# Altium project UCLA-DRS4.PrjPCB (part 10 of 10)
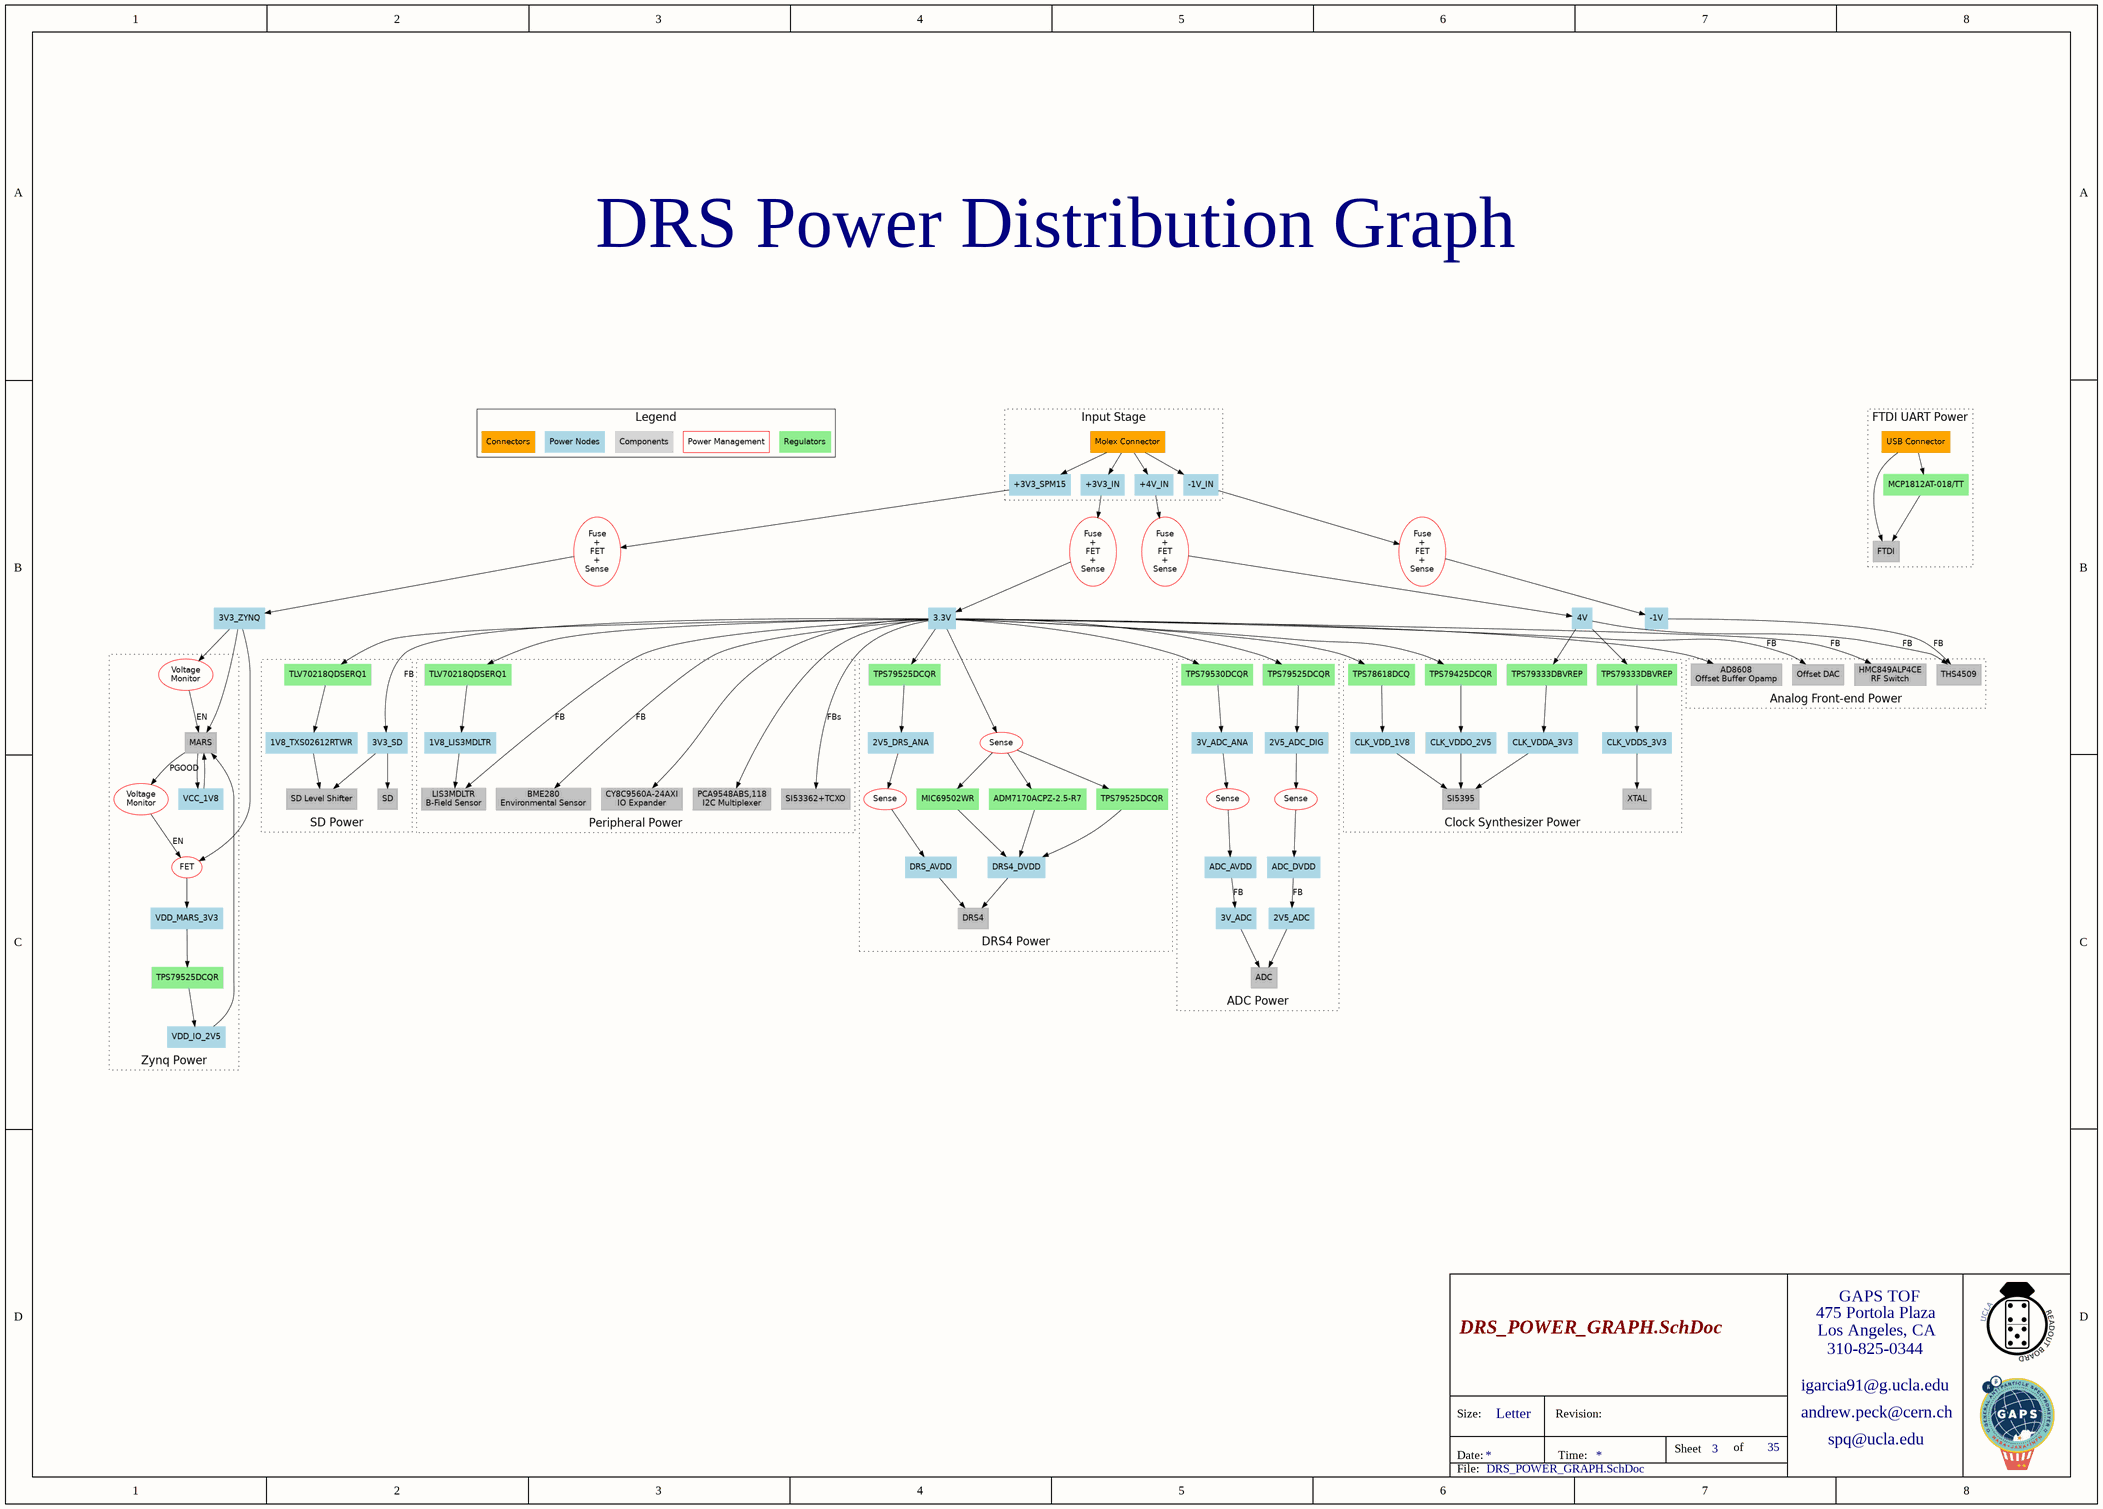
[diagram p134: DRS_POWER_GRAPH.SchDoc]

## Nets that join several sheets
1V8_TXS02612RTWR: MARS_MIO (C265.1 R18.2 U10.1 U35.5), 1V8_SUPPLY (C333.2 U7.5)
2V5_ADC_DIG: DRS4_ADC (R128.4 U24.8), 3V_ADC_SUPPLY (C27.2 TP20.1 U6.4)
2V5_DRS_ANA: DRS4 (R89.4 U18.8), 2V5_DRS4_SUPPLY (C9.2 TP10.1 U1.4)
3.3V: ToF (D25.3 D28.3 J1.5), DRS4 (16 pins), DRS-Module 0/FE0 (FB10A.1), DRS4_ADC (14 pins), DRS-Module 0/FE2 (FB10B.1), DRS-Module 0/FE4 (FB10C.1), DRS-Module 0/FE6 (FB10D.1), DRS-Module 0/FE1 (FB10E.1), DRS-Module 0/FE3 (FB10F.1), DRS-Module 0/FE5 (FB10G.1), DRS-Module 0/FE7 (FB10H.1), ANA_FE_CLK_SYNTH (FB13.1), ENET (5 pins), DAC (FB27.1 FB28.1 FB29.1), CLK_SYNTH (Q8.2 Q9.2 R48.2 R49.2), TCA_CLK_DIST (6 pins), MARS_MIO (FB23.1), CLK_PWR (8 pins), 2V5_DRS4_SUPPLY (C7.2 D8.1 R7.1 U1.2), 3V_ADC_SUPPLY (8 pins), MarsCarrier_PWR (6 pins), 3_3V_DIST (C5.1 C6.1 FB3.2 TP8.1), Sensors (23 pins), MARS_GPIO_MISC (8 pins), DRS4_GPIO_EXPANDER (8 pins), GPIO_EXPANDER_LED (J15.1), I2C_MULTIPLEX (43 pins), 1V8_SUPPLY (C334.2 U7.1 U7.3)
3V_ADC_ANA: DRS4_ADC (R127.4 U23.8), 3V_ADC_SUPPLY (C23.2 TP18.1 U5.4)
4V: DRS-Module 0/FE0 (FB11A.1), DRS-Module 0/FE2 (FB11B.1), DRS-Module 0/FE4 (FB11C.1), DRS-Module 0/FE6 (FB11D.1), DRS-Module 0/FE1 (FB11E.1), DRS-Module 0/FE3 (FB11F.1), DRS-Module 0/FE5 (FB11G.1), DRS-Module 0/FE7 (FB11H.1), ANA_FE_CLK_SYNTH (FB14.1), CLK_PWR (8 pins), 4V_DIST (C1.1 C2.1 FB1.2 TP2.1), Sensors (U30.8)
+3V3_IN: ToF (D1.1 J2.1), 3_3V_DIST (F3.1 TP7.1)
+3V3_SPM15: ToF (D2.1 J2.3), 3V3_DIST_ZYNQ (F2.1 TP5.1)
+4V_IN: ToF (D4.1 J2.7), 4V_DIST (F1.1 TP1.1)
-1V_IN: ToF (D3.1 J2.5), -1V_DIST (F4.1 TP22.1)
-1V_VBUS: DRS-Module 0/FE0 (FB12A.1), DRS-Module 0/FE2 (FB12B.1), DRS-Module 0/FE4 (FB12C.1), DRS-Module 0/FE6 (FB12D.1), DRS-Module 0/FE1 (FB12E.1), DRS-Module 0/FE3 (FB12F.1), DRS-Module 0/FE5 (FB12G.1), DRS-Module 0/FE7 (FB12H.1), ANA_FE_CLK_SYNTH (FB15.1), -1V_DIST (C29.2 C30.2 FB4.2 TP23.1), Sensors (C41.2 R124.2 U43.2)
CLK_VDD_1V8: CLK_SYNTH (6 pins), CLK_PWR (C32.2 TP25.1 U8.4)
CLK_VDDA_3V3: CLK_SYNTH (C96.2 FB6.1), CLK_PWR (C44.2 TP31.1 U11.5)
CLK_VDDO_2V5: CLK_SYNTH (16 pins), CLK_PWR (C35.2 TP27.1 U9.4)
CLK_VDDS_3V3: CLK_SYNTH (C95.1 L1.2 R58.2), CLK_PWR (C47.2 TP33.1 U12.5)
DRS4_2V5_ADM: DRS4 (J7.2), 2V5_DRS4_SUPPLY (C18.2 U4.5 U4.7 U4.8)
DRS4_2V5_MIC: DRS4 (J8.2), 2V5_DRS4_SUPPLY (5 pins)
DRS4_2V5_TPS: DRS4 (J6.2), 2V5_DRS4_SUPPLY (C11.2 D9.1 R8.1 U2.2)
DRS4_DVDD: DRS4 (20 pins), 2V5_DRS4_SUPPLY (13 pins)
NEUTRAL: ENET (T1.S1 T1.S2), MARS_FTDI (J12.6 J12.7 J12.8 J12.9)
TRB_GND: ToF (11 pins), DRS4 (62 pins), DRS-Module 0/FE0 (36 pins), DRS4_ADC (41 pins), DRS-Module 0/FE2 (36 pins), DRS-Module 0/FE4 (36 pins), DRS-Module 0/FE6 (36 pins), DRS-Module 0/FE1 (36 pins), DRS-Module 0/FE3 (36 pins), DRS-Module 0/FE5 (36 pins), DRS-Module 0/FE7 (36 pins), ANA_FE_CLK_SYNTH (38 pins), MarsCarrier (45 pins), ENET (9 pins), DAC (21 pins), CLK_SYNTH (25 pins), TCA_CLK_DIST (10 pins), TCA_LP_FILTER (54 pins), MARS_MIO (23 pins), CLK_PWR (26 pins), 2V5_DRS4_SUPPLY (27 pins), 4V_DIST (C1.2 C2.2 R2.1 TP3.1), -1V_DIST (C29.1 C30.1 TP24.1), 3V_ADC_SUPPLY (14 pins), MarsCarrier_PWR (50 pins), MARS_PORB (11 pins), 3V3_DIST_ZYNQ (C3.2 C4.2 R4.1 TP6.1), 3_3V_DIST (C5.2 C6.2 R6.1 TP9.1), Sensors (33 pins), MARS_GPIO_MISC (32 pins), MARS_FTDI (25 pins), DRS4_GPIO_EXPANDER (11 pins), GPIO_EXPANDER_LED (23 pins), I2C_HEADER (7 pins), I2C_MULTIPLEX (7 pins), 1V8_SUPPLY (C333.1 C334.1 U7.2)
VCC_1V8_PS: MarsCarrier (11 pins), MarsCarrier_PWR (5 pins)
VCC_3V3: MarsCarrier (9 pins), MarsCarrier_PWR (8 pins), MARS_PORB (9 pins), 3V3_DIST_ZYNQ (C3.1 C4.1 FB2.2 TP4.1)
VCC_IO_B34: MarsCarrier (6 pins), MarsCarrier_PWR (15 pins)
3V3_SENSE_N: 3_3V_DIST (R5.4), Sensors (R206.2)
3V3_SENSE_P: 3_3V_DIST (R5.1), Sensors (R212.2)
3V3_ZYNQ_SENSE_N: MarsCarrier_PWR (R30.1), 3V3_DIST_ZYNQ (R3.4)
3V3_ZYNQ_SENSE_P: MarsCarrier_PWR (R33.1), 3V3_DIST_ZYNQ (R3.1)
4V_SENSE_N: 4V_DIST (R1.4), Sensors (R207.2)
4V_SENSE_P: 4V_DIST (R1.1), Sensors (R213.2)
-1V_SENSE_N: -1V_DIST (R14.1), Sensors (R208.2)
-1V_SENSE_P: -1V_DIST (R14.4), Sensors (R214.2)
ADC_CLK: DRS4_ADC (U21.2), CLK_SYNTH (R50.1)
BIAS: DRS4 (R94.1), DAC (TP80.1 U37.9)
BOOT_MODE: MarsCarrier (J4.190), MarsCarrier_PWR (J3.2)
CLK_SYNTH_8: ANA_FE_CLK_SYNTH (C235.2 L6.1), CLK_SYNTH (R52.1)
DAC_~{CLR}: DRS4_GPIO_EXPANDER (U16.5), I2C_HEADER (J17.4)
DAC_~{IRQ}: DRS4_GPIO_EXPANDER (U16.4), I2C_HEADER (J17.5)
DRS4~{_RESET}: DRS4 (U17.35), MarsCarrier (J4.93)
DRS4_A0: DRS4 (U17.31), MarsCarrier (J4.99)
DRS4_A1: DRS4 (U17.32), MarsCarrier (J4.97)
DRS4_A2: DRS4 (U17.60), MarsCarrier (J4.35)
DRS4_A3: DRS4 (U17.61), MarsCarrier (J4.31)
DRS4_DENABLE: DRS4 (R101.2 U17.74), MarsCarrier (J4.19)
DRS4_DTAP: DRS4 (U17.62), MarsCarrier (J4.29)
DRS4_DWRITE: DRS4 (R102.2 U17.73), MarsCarrier (J4.23)
DRS4_IN0_N: DRS4 (R109.2 U17.4), DRS-Module 0/FE0 (R175A.2 R180A.2)
DRS4_IN0_P: DRS4 (R109.1 U17.3), DRS-Module 0/FE0 (R174A.2 R179A.2)
DRS4_IN1_N: DRS4 (R110.2 U17.6), DRS-Module 0/FE1 (R175E.2 R180E.2)
DRS4_IN1_P: DRS4 (R110.1 U17.5), DRS-Module 0/FE1 (R174E.2 R179E.2)
DRS4_IN2_N: DRS4 (R111.2 U17.8), DRS-Module 0/FE2 (R175B.2 R180B.2)
DRS4_IN2_P: DRS4 (R111.1 U17.7), DRS-Module 0/FE2 (R174B.2 R179B.2)
DRS4_IN3_N: DRS4 (R112.2 U17.10), DRS-Module 0/FE3 (R175F.2 R180F.2)
DRS4_IN3_P: DRS4 (R112.1 U17.9), DRS-Module 0/FE3 (R174F.2 R179F.2)
DRS4_IN4_N: DRS4 (R113.2 U17.12), DRS-Module 0/FE4 (R175C.2 R180C.2)
DRS4_IN4_P: DRS4 (R113.1 U17.11), DRS-Module 0/FE4 (R174C.2 R179C.2)
DRS4_IN5_N: DRS4 (R114.2 U17.14), DRS-Module 0/FE5 (R175G.2 R180G.2)
DRS4_IN5_P: DRS4 (R114.1 U17.13), DRS-Module 0/FE5 (R174G.2 R179G.2)
DRS4_IN6_N: DRS4 (R115.2 U17.16), DRS-Module 0/FE6 (R175D.2 R180D.2)
DRS4_IN6_P: DRS4 (R115.1 U17.15), DRS-Module 0/FE6 (R174D.2 R179D.2)
DRS4_IN7_N: DRS4 (R116.2 U17.18), DRS-Module 0/FE7 (R175H.2 R180H.2)
DRS4_IN7_P: DRS4 (R116.1 U17.17), DRS-Module 0/FE7 (R174H.2 R179H.2)
DRS4_IN8_N: DRS4 (R117.2 U17.21), ANA_FE_CLK_SYNTH (R186.2 R192.2)
DRS4_IN8_P: DRS4 (R117.1 U17.20), ANA_FE_CLK_SYNTH (R185.2 R191.2)
DRS4_OUT8_N: DRS4 (U17.38), DRS4_ADC (R140.1)
DRS4_OUT8_P: DRS4 (U17.37), DRS4_ADC (R143.1)
DRS4_PLLLCK: DRS4 (R98.1), MarsCarrier (J4.25)
DRS4_RSRLOAD: DRS4 (U17.29), MarsCarrier (J4.103)
DRS4_SRCLK: DRS4 (R106.1 U17.28), MarsCarrier (J4.105)
DRS4_SRIN: DRS4 (U17.27), MarsCarrier (J4.113)
DRS4_SROUT: DRS4 (U17.26), MarsCarrier (J4.115)
DRS4_WSRIN: DRS4 (U17.75), MarsCarrier (J4.17)
DRS4_WSROUT: DRS4 (U17.25), MarsCarrier (J4.119)
ETH_A_N: MarsCarrier (J4.169), ENET (D30.5 T1.11)
ETH_A_P: MarsCarrier (J4.171), ENET (D30.4 T1.10)
ETH_B_N: MarsCarrier (J4.177), ENET (D30.2 T1.5)
ETH_B_P: MarsCarrier (J4.179), ENET (D30.1 T1.4)
ETH_C_N: MarsCarrier (J4.183), ENET (D29.5 T1.3)
ETH_C_P: MarsCarrier (J4.185), ENET (D29.4 T1.2)
ETH_CTREF: MarsCarrier (J4.181), ENET (R64.2)
ETH_D_N: MarsCarrier (J4.191), ENET (D29.2 T1.9)
ETH_D_P: MarsCarrier (J4.193), ENET (D29.1 T1.8)
ETH_LED1#: MarsCarrier (J4.173), ENET (R66.2)
ETH_LED2#: MarsCarrier (J4.175), ENET (R67.2)
FPGA_DONE: MarsCarrier (J4.194), MarsCarrier_PWR (Q6.2 R28.2)
GPIO0_N: MarsCarrier (J4.125), MARS_GPIO_MISC (D54.4 J14.3)
GPIO0_P: MarsCarrier (J4.123), MARS_GPIO_MISC (D54.6 J14.1)
GPIO1_N: MarsCarrier (J4.131), MARS_GPIO_MISC (D54.3 J14.7)
GPIO1_P: MarsCarrier (J4.129), MARS_GPIO_MISC (D54.1 J14.5)
GPIO2_N: MarsCarrier (J4.135), MARS_GPIO_MISC (D55.4 J14.11)
GPIO2_P: MarsCarrier (J4.133), MARS_GPIO_MISC (D55.6 J14.9)
GPIO3_N: MarsCarrier (J4.104), MARS_GPIO_MISC (D55.3 J14.15)
GPIO3_P: MarsCarrier (J4.102), MARS_GPIO_MISC (D55.1 J14.13)
GPIO4_N: MarsCarrier (J4.110), MARS_GPIO_MISC (D56.4 J14.19)
GPIO4_P: MarsCarrier (J4.108), MARS_GPIO_MISC (D56.6 J14.17)
GPIO5_N: MarsCarrier (J4.114), MARS_GPIO_MISC (D56.3 J14.23)
GPIO5_P: MarsCarrier (J4.112), MARS_GPIO_MISC (D56.1 J14.21)
GPIO6_N: MarsCarrier (J4.120), MARS_GPIO_MISC (D57.4 J14.27)
GPIO6_P: MarsCarrier (J4.118), MARS_GPIO_MISC (D57.6 J14.25)
GPIO7_N: MarsCarrier (J4.124), MARS_GPIO_MISC (D57.3 J14.31)
GPIO7_P: MarsCarrier (J4.122), MARS_GPIO_MISC (D57.1 J14.29)
HMC849:EN0: DRS-Module 0/FE0 (U25A.5), DRS4_GPIO_EXPANDER (R68.2), GPIO_EXPANDER_LED (R301.2)
HMC849:EN1: DRS-Module 0/FE1 (U25E.5), DRS4_GPIO_EXPANDER (R71.2), GPIO_EXPANDER_LED (R302.2)
HMC849:EN2: DRS-Module 0/FE2 (U25B.5), DRS4_GPIO_EXPANDER (R73.2), GPIO_EXPANDER_LED (R303.2)
HMC849:EN3: DRS-Module 0/FE3 (U25F.5), DRS4_GPIO_EXPANDER (R75.2), GPIO_EXPANDER_LED (R304.2)
HMC849:EN4: DRS-Module 0/FE4 (U25C.5), DRS4_GPIO_EXPANDER (R77.2), GPIO_EXPANDER_LED (R317.2)
HMC849:EN5: DRS-Module 0/FE5 (U25G.5), DRS4_GPIO_EXPANDER (R79.2), GPIO_EXPANDER_LED (R318.2)
HMC849:EN6: DRS-Module 0/FE6 (U25D.5), DRS4_GPIO_EXPANDER (R81.2), GPIO_EXPANDER_LED (R319.2)
HMC849:EN7: DRS-Module 0/FE7 (U25H.5), DRS4_GPIO_EXPANDER (R83.2), GPIO_EXPANDER_LED (R320.2)
HMC849:EN8: ANA_FE_CLK_SYNTH (U26.5), DRS4_GPIO_EXPANDER (R85.2)
HMC849:VCTL0: DRS-Module 0/FE0 (U25A.2), DRS4_GPIO_EXPANDER (R70.2), GPIO_EXPANDER_LED (R305.1)
HMC849:VCTL1: DRS-Module 0/FE1 (U25E.2), DRS4_GPIO_EXPANDER (R72.2), GPIO_EXPANDER_LED (R306.1)
HMC849:VCTL2: DRS-Module 0/FE2 (U25B.2), DRS4_GPIO_EXPANDER (R74.2), GPIO_EXPANDER_LED (R307.1)
HMC849:VCTL3: DRS-Module 0/FE3 (U25F.2), DRS4_GPIO_EXPANDER (R76.2), GPIO_EXPANDER_LED (R308.1)
HMC849:VCTL4: DRS-Module 0/FE4 (U25C.2), DRS4_GPIO_EXPANDER (R78.2), GPIO_EXPANDER_LED (R321.1)
HMC849:VCTL5: DRS-Module 0/FE5 (U25G.2), DRS4_GPIO_EXPANDER (R80.2), GPIO_EXPANDER_LED (R322.1)
HMC849:VCTL6: DRS-Module 0/FE6 (U25D.2), DRS4_GPIO_EXPANDER (R82.2), GPIO_EXPANDER_LED (R323.1)
HMC849:VCTL7: DRS-Module 0/FE7 (U25H.2), DRS4_GPIO_EXPANDER (R84.2), GPIO_EXPANDER_LED (R324.1)
HMC849:VCTL8: ANA_FE_CLK_SYNTH (U26.2), DRS4_GPIO_EXPANDER (R86.2)
I2C_SCL: MarsCarrier (J4.178), MARS_MIO (R249.2 U46.4)
I2C_SDA: MarsCarrier (J4.176), MARS_MIO (R248.2 U46.5)
~{IN}~{_OFS}: DRS-Module 0/FE0 (L3A.1), DRS-Module 0/FE2 (L3B.1), DRS-Module 0/FE4 (L3C.1), DRS-Module 0/FE6 (L3D.1), DRS-Module 0/FE1 (L3E.1), DRS-Module 0/FE3 (L3F.1), DRS-Module 0/FE5 (L3G.1), DRS-Module 0/FE7 (L3H.1), ANA_FE_CLK_SYNTH (L5.1), DAC (R289.2 TP40.1)
IN+_OFS: DRS-Module 0/FE0 (L2A.2), DRS-Module 0/FE2 (L2B.2), DRS-Module 0/FE4 (L2C.2), DRS-Module 0/FE6 (L2D.2), DRS-Module 0/FE1 (L2E.2), DRS-Module 0/FE3 (L2F.2), DRS-Module 0/FE5 (L2G.2), DRS-Module 0/FE7 (L2H.2), ANA_FE_CLK_SYNTH (L4.2), DAC (R291.2 TP42.1)
IO_B34_L7_Y16_P: DRS4_ADC (R157.2), MarsCarrier (J4.59)
IO_B34_L7_Y17_N: DRS4_ADC (R154.2), MarsCarrier (J4.61)
IO_B34_L10_V15_P: DRS4_ADC (R159.2), MarsCarrier (J4.55)
IO_B34_L10_W15_N: DRS4_ADC (R158.2), MarsCarrier (J4.57)
IO_B34_L17_Y18_P: DRS4_ADC (R153.2), MarsCarrier (J4.65)
IO_B34_L17_Y19_N: DRS4_ADC (R152.2), MarsCarrier (J4.67)
IO_B34_L19_R17_N: DRS4_ADC (R160.2), MarsCarrier (J4.37)
IO_B34_L22_W18_P: DRS4_ADC (R151.2), MarsCarrier (J4.69)
IO_B34_L22_W19_N: DRS4_ADC (R150.2), MarsCarrier (J4.71)
IO_B35_L3_N: ToF (D25.1 J1.10), MarsCarrier (J4.144)
IO_B35_L3_P: ToF (D25.2 J1.9), MarsCarrier (J4.142)
IO_B35_L5_N: ToF (D25.4 J1.8), MarsCarrier (J4.140)
IO_B35_L5_P: ToF (D25.5 J1.7), MarsCarrier (J4.138)
IO_B35_L6_N: ToF (D28.4 J1.3), MarsCarrier (J4.134)
IO_B35_L6_P: ToF (D28.5 J1.4), MarsCarrier (J4.132)
IO_B35_L7_M19_P: DRS4_ADC (R146.2), MarsCarrier (J4.79)
IO_B35_L7_M20_N: DRS4_ADC (R145.2), MarsCarrier (J4.81)
IO_B35_L9_L19_P: DRS4_ADC (R144.2), MarsCarrier (J4.91)
IO_B35_L15_AD12_F20_N: MarsCarrier (J4.121), DRS4_GPIO_EXPANDER (R87.1)
IO_B35_L21_N15_P: DRS4_ADC (R149.2), MarsCarrier (J4.75)
IO_B35_L21_N16_N: DRS4_ADC (R148.2), MarsCarrier (J4.77)
IO_MIO41_B13_L16_W9: MarsCarrier (J4.141), MARS_MIO (U35.4)
IO_MIO42_B13_L18_W11: MarsCarrier (J4.143), MARS_MIO (U35.6)
IO_MIO43_B13_L18_Y11: MarsCarrier (J4.145), MARS_MIO (U35.7)
IO_MIO44_B13_L14_SRCC_Y9: MarsCarrier (J4.149), MARS_MIO (U35.1)
IO_MIO45_B13_L14_Y8: MarsCarrier (J4.151), MARS_MIO (U35.3)
IO_MIO46_B13_L19_T5: MarsCarrier (J4.153), MARS_FTDI (R197.2 R198.2)
IO_MIO47_B13_L19_U5: MarsCarrier (J4.155), MARS_FTDI (R196.2 R199.2)
MCLK_N: ToF (D28.1 J1.1), CLK_SYNTH (C89.1)
MCLK_P: ToF (D28.2 J1.2), CLK_SYNTH (C87.1)
OUT0A_N: MarsCarrier (J4.6), CLK_SYNTH (U15.20)
OUT0A_P: MarsCarrier (J4.4), CLK_SYNTH (U15.21)
OUT2_N: DRS4 (R93.2 U17.67), CLK_SYNTH (U15.30)
OUT2_P: DRS4 (R93.1 U17.66), CLK_SYNTH (U15.31)
POR: MarsCarrier (J4.196), MarsCarrier_PWR (C61.1 S2.1 S2.2), MARS_PORB (Q38.6)
POWER_EN: MarsCarrier (J4.13), MarsCarrier_PWR (R29.1), MARS_PORB (U44.5 U45.7)
POWER_GOOD: MarsCarrier (J4.40), MarsCarrier_PWR (Q6.5 R29.2)
PS_SRST#: MarsCarrier (J4.192), MarsCarrier_PWR (C62.1 S1.1 S1.2)
R-OFS: DRS4 (C127.1 C128.2 C129.2 U17.30), DAC (U37.18)
SCL: MARS_MIO (R247.1 R249.1), I2C_HEADER (J16.2 J17.2 U47.5 U48.5), I2C_MULTIPLEX (U39.19 U40.19)
SCL_3V3_INA226: Sensors (U29.5), I2C_MULTIPLEX (R365.1 U40.11)
SCL_4V_INA226: Sensors (U30.2 U30.5), I2C_MULTIPLEX (R366.1 U40.17)
SCL_-1V_MAX116: Sensors (U49.5), I2C_MULTIPLEX (R368.1 U40.15)
SCL_ADCINA226_AVDD: DRS4_ADC (U23.1 U23.2 U23.5), I2C_MULTIPLEX (R353.1 U39.13)
SCL_ADCINA226_DVDD: DRS4_ADC (U24.5), I2C_MULTIPLEX (R346.1 U39.8)
SCL_ADCTMP112: DRS4_ADC (U22.1), I2C_MULTIPLEX (R348.1 U39.11)
SCL_BME280: Sensors (U34.4), I2C_MULTIPLEX (R357.1 U40.2)
SCL_ClkSensorTMP112: Sensors (U33.1 U33.4), I2C_MULTIPLEX (R340.1 U39.2)
SCL_CY8C9560A: DRS4_GPIO_EXPANDER (U16.24), I2C_MULTIPLEX (R349.1 U39.17)
SCL_DAC: DAC (U37.3), I2C_MULTIPLEX (R344.1 U39.6)
SCL_DRS4INA226: DRS4 (U19.1 U19.5), I2C_MULTIPLEX (R363.1 U40.8)
SCL_DRS4INA226_AVDD: DRS4 (U18.5), I2C_MULTIPLEX (R351.1 U39.15)
SCL_DRS4TMP112: DRS4 (U20.1), I2C_MULTIPLEX (R361.1 U40.6)
SCL_LIS3MDLTR: Sensors (U32.1), I2C_MULTIPLEX (R359.1 U40.4)
SCL_SI5395: CLK_SYNTH (U15.16), I2C_MULTIPLEX (R342.1 U39.4)
SCL_Zynq_INA226: MarsCarrier_PWR (U14.5), I2C_MULTIPLEX (R370.1 U40.13)
SDA: MARS_MIO (R246.1 R248.1), I2C_HEADER (J16.3 J17.3 U47.4 U48.4), I2C_MULTIPLEX (U39.20 U40.20)
SDA_3V3_INA226: Sensors (U29.4), I2C_MULTIPLEX (R364.1 U40.10)
SDA_4V_INA226: Sensors (U30.4), I2C_MULTIPLEX (R367.1 U40.16)
SDA_-1V_MAX116: Sensors (U49.6), I2C_MULTIPLEX (R369.1 U40.14)
SDA_ADCINA226_AVDD: DRS4_ADC (U23.4), I2C_MULTIPLEX (R354.1 U39.12)
SDA_ADCINA226_DVDD: DRS4_ADC (U24.2 U24.4), I2C_MULTIPLEX (R345.1 U39.7)
SDA_ADCTMP112: DRS4_ADC (U22.4 U22.6), I2C_MULTIPLEX (R347.1 U39.10)
SDA_BME280: Sensors (U34.3), I2C_MULTIPLEX (R356.1 U40.1)
SDA_ClkSensorTMP112: Sensors (U33.6), I2C_MULTIPLEX (R339.1 U39.1)
SDA_CY8C9560A: DRS4_GPIO_EXPANDER (U16.28), I2C_MULTIPLEX (R350.1 U39.16)
SDA_DAC: DAC (U37.13), I2C_MULTIPLEX (R343.1 U39.5)
SDA_DRS4INA226: DRS4 (U19.2 U19.4), I2C_MULTIPLEX (R362.1 U40.7)
SDA_DRS4INA226_AVDD: DRS4 (U18.4), I2C_MULTIPLEX (R352.1 U39.14)
SDA_DRS4TMP112: DRS4 (U20.6), I2C_MULTIPLEX (R360.1 U40.5)
SDA_LIS3MDLTR: Sensors (U32.11), I2C_MULTIPLEX (R358.1 U40.3)
SDA_SI5395: CLK_SYNTH (U15.18), I2C_MULTIPLEX (R341.1 U39.3)
SDA_Zynq_INA226: MarsCarrier_PWR (U14.4), I2C_MULTIPLEX (R371.1 U40.12)
SDIO_CLK: MarsCarrier (R36.2), MARS_MIO (U35.9)
Si5395_FDEC: CLK_SYNTH (U15.25), DRS4_GPIO_EXPANDER (U16.10), GPIO_EXPANDER_LED (R331.1)
Si5395_FINC: CLK_SYNTH (U15.48), DRS4_GPIO_EXPANDER (U16.7), GPIO_EXPANDER_LED (R329.2)
Si5395_~{OE}: CLK_SYNTH (U15.11), DRS4_GPIO_EXPANDER (U16.9), GPIO_EXPANDER_LED (R333.1)
Si5395_~{RST}: CLK_SYNTH (U15.6), DRS4_GPIO_EXPANDER (U16.8), GPIO_EXPANDER_LED (R335.2)
TC_0: DRS-Module 0/FE0 (C208A.2), TCA_LP_FILTER (R261.2 R264.2)
TC_1: DRS-Module 0/FE1 (C208E.2), TCA_LP_FILTER (R267.2 R270.2)
TC_2: DRS-Module 0/FE2 (C208B.2), TCA_LP_FILTER (R273.2 R276.2)
TC_3: DRS-Module 0/FE3 (C208F.2), TCA_LP_FILTER (R279.2 R282.2)
TC_4: DRS-Module 0/FE4 (C208C.2), TCA_LP_FILTER (R285.2 R287.2)
TC_5: DRS-Module 0/FE5 (C208G.2), TCA_LP_FILTER (R262.2 R266.2)
TC_6: DRS-Module 0/FE6 (C208D.2), TCA_LP_FILTER (R268.2 R271.2)
TC_7: DRS-Module 0/FE7 (C208H.2), TCA_LP_FILTER (R274.2 R277.2)
TC_8: ANA_FE_CLK_SYNTH (C229.2), TCA_LP_FILTER (R280.2 R284.2)
TCA_CLK0: TCA_CLK_DIST (R255.2), TCA_LP_FILTER (C279.2 L10.1)
TCA_CLK1: TCA_CLK_DIST (R254.2), TCA_LP_FILTER (C287.2 L16.1)
TCA_CLK2: TCA_CLK_DIST (R253.2), TCA_LP_FILTER (C295.2 L22.1)
TCA_CLK3: TCA_CLK_DIST (R252.2), TCA_LP_FILTER (C303.2 L28.1)
TCA_CLK4: TCA_CLK_DIST (R250.2), TCA_LP_FILTER (C311.2 L34.1)
TCA_CLK5: TCA_CLK_DIST (R259.2), TCA_LP_FILTER (C283.2 L13.1)
TCA_CLK6: TCA_CLK_DIST (R258.2), TCA_LP_FILTER (C291.2 L19.1)
TCA_CLK7: TCA_CLK_DIST (R257.2), TCA_LP_FILTER (C299.2 L25.1)
TCA_CLK8: TCA_CLK_DIST (R256.2), TCA_LP_FILTER (C307.2 L31.1)
TCA_CLK_0T05_EN: TCA_CLK_DIST (U36.1), DRS4_GPIO_EXPANDER (U16.37), GPIO_EXPANDER_LED (R332.1)
TCA_CLK_6T08_EN: TCA_CLK_DIST (U36.18), DRS4_GPIO_EXPANDER (U16.36), GPIO_EXPANDER_LED (R330.2)
V_CM: DRS-Module 0/FE0 (C202A.1 C205A.1 OP1A.4 OP1A.9), DRS-Module 0/FE2 (C202B.1 C205B.1 OP1B.4 OP1B.9), DRS-Module 0/FE4 (C202C.1 C205C.1 OP1C.4 OP1C.9), DRS-Module 0/FE6 (C202D.1 C205D.1 OP1D.4 OP1D.9), DRS-Module 0/FE1 (C202E.1 C205E.1 OP1E.4 OP1E.9), DRS-Module 0/FE3 (C202F.1 C205F.1 OP1F.4 OP1F.9), DRS-Module 0/FE5 (C202G.1 C205G.1 OP1G.4 OP1G.9), DRS-Module 0/FE7 (C202H.1 C205H.1 OP1H.4 OP1H.9), ANA_FE_CLK_SYNTH (C223.1 C226.1 OP2.4 OP2.9), DAC (R288.1 TP41.1)
VCAL_RESET: DAC (U37.14), DRS4_GPIO_EXPANDER (R88.1), GPIO_EXPANDER_LED (R334.1)

## Assembly variants
DNI: not fitted R372 R376